# Altium schematic sheet Top_level.SchDoc
size 420 x 297 mm
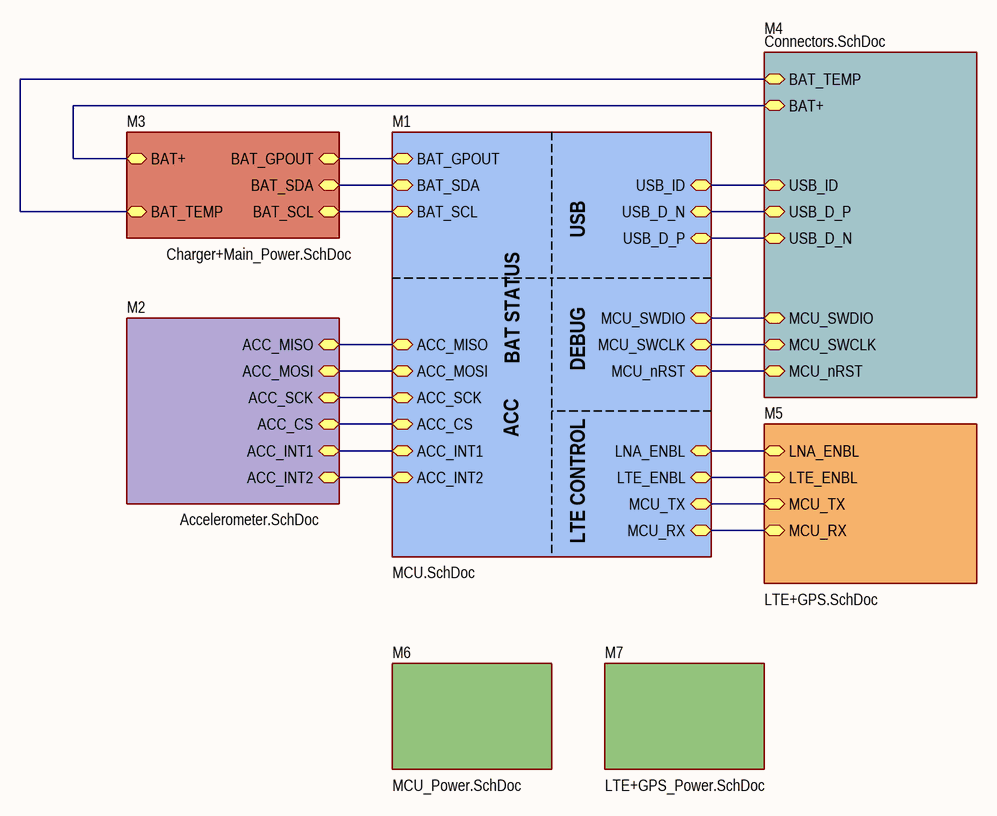
[diagram p0: Top_level.SchDoc]

## Sub-sheets
M1 = MCU.SchDoc: BAT_GPOUT (bidir), BAT_SDA (bidir), BAT_SCL (bidir), ACC_INT2 (bidir), ACC_CS (bidir), LTE_ENBL (bidir), MCU_RX (bidir), ACC_MISO (bidir), ACC_MOSI (bidir), MCU_TX (bidir), MCU_nRST (bidir), MCU_SWCLK (bidir), MCU_SWDIO (bidir), USB_D_N (bidir), USB_D_P (bidir), ACC_INT1 (bidir), ACC_SCK (bidir), USB_ID (bidir), LNA_ENBL (bidir)
M2 = Accelerometer.SchDoc: ACC_MOSI (bidir), ACC_INT1 (bidir), ACC_CS (bidir), ACC_INT2 (bidir), ACC_SCK (bidir), ACC_MISO (bidir)
M3 = Charger+Main_Power.SchDoc: BAT_GPOUT (bidir), BAT_SDA (bidir), BAT_TEMP (bidir), BAT_SCL (bidir), BAT+ (bidir)
M4 = Connectors.SchDoc: BAT_TEMP (bidir), BAT+ (bidir), MCU_SWDIO (bidir), MCU_nRST (bidir), USB_D_P (bidir), USB_ID (bidir), MCU_SWCLK (bidir), USB_D_N (bidir)
M5 = LTE+GPS.SchDoc: LNA_ENBL (bidir), LTE_ENBL (bidir), MCU_RX (bidir), MCU_TX (bidir)
M6 = MCU_Power.SchDoc: no entries
M7 = LTE+GPS_Power.SchDoc: no entries

## Nets
(unnamed): sheet M1/BAT_GPOUT, sheet M3/BAT_GPOUT
(unnamed): sheet M1/BAT_SDA, sheet M3/BAT_SDA
(unnamed): sheet M1/BAT_SCL, sheet M3/BAT_SCL
(unnamed): sheet M1/ACC_INT2, sheet M2/ACC_INT2
(unnamed): sheet M1/ACC_CS, sheet M2/ACC_CS
(unnamed): sheet M1/LTE_ENBL, sheet M5/LTE_ENBL
(unnamed): sheet M1/MCU_RX, sheet M5/MCU_RX
(unnamed): sheet M1/ACC_MISO, sheet M2/ACC_MISO
(unnamed): sheet M1/ACC_MOSI, sheet M2/ACC_MOSI
(unnamed): sheet M1/MCU_TX, sheet M5/MCU_TX
(unnamed): sheet M1/MCU_nRST, sheet M4/MCU_nRST
(unnamed): sheet M1/MCU_SWCLK, sheet M4/MCU_SWCLK
(unnamed): sheet M1/MCU_SWDIO, sheet M4/MCU_SWDIO
(unnamed): sheet M1/USB_D_N, sheet M4/USB_D_P
(unnamed): sheet M1/USB_D_P, sheet M4/USB_D_N
(unnamed): sheet M1/ACC_INT1, sheet M2/ACC_INT1
(unnamed): sheet M1/ACC_SCK, sheet M2/ACC_SCK
(unnamed): sheet M1/USB_ID, sheet M4/USB_ID
(unnamed): sheet M1/LNA_ENBL, sheet M5/LNA_ENBL
(unnamed): sheet M3/BAT_TEMP, sheet M4/BAT_TEMP
(unnamed): sheet M3/BAT+, sheet M4/BAT+

## Notes on the sheet
- USB
- BAT STATUS
- DEBUG
- ACC
- LTE CONTROL
- Author
- Manufacturer
- Date
- Page
- Total pages
- Size page
- A3
- Materials